# Altium schematic sheet MCU_SEC.SchDoc
size A3; PageSetup: Record=PageOptions|CenterHorizontal=True|CenterVertical=True|PrintScale=0.73|XCorrection=1.00|YCorrection=1.00|PrintKind=0|BorderSize=5000000|LeftOffset=0|BottomOffset=0|Orientation=2|PaperLength=1000|PaperWidth=1000|Scale=100|PaperSource=7|PrintQuality=-4|MediaType=1|DitherType=10|PaperKind=A4|PrintScaleMode=1
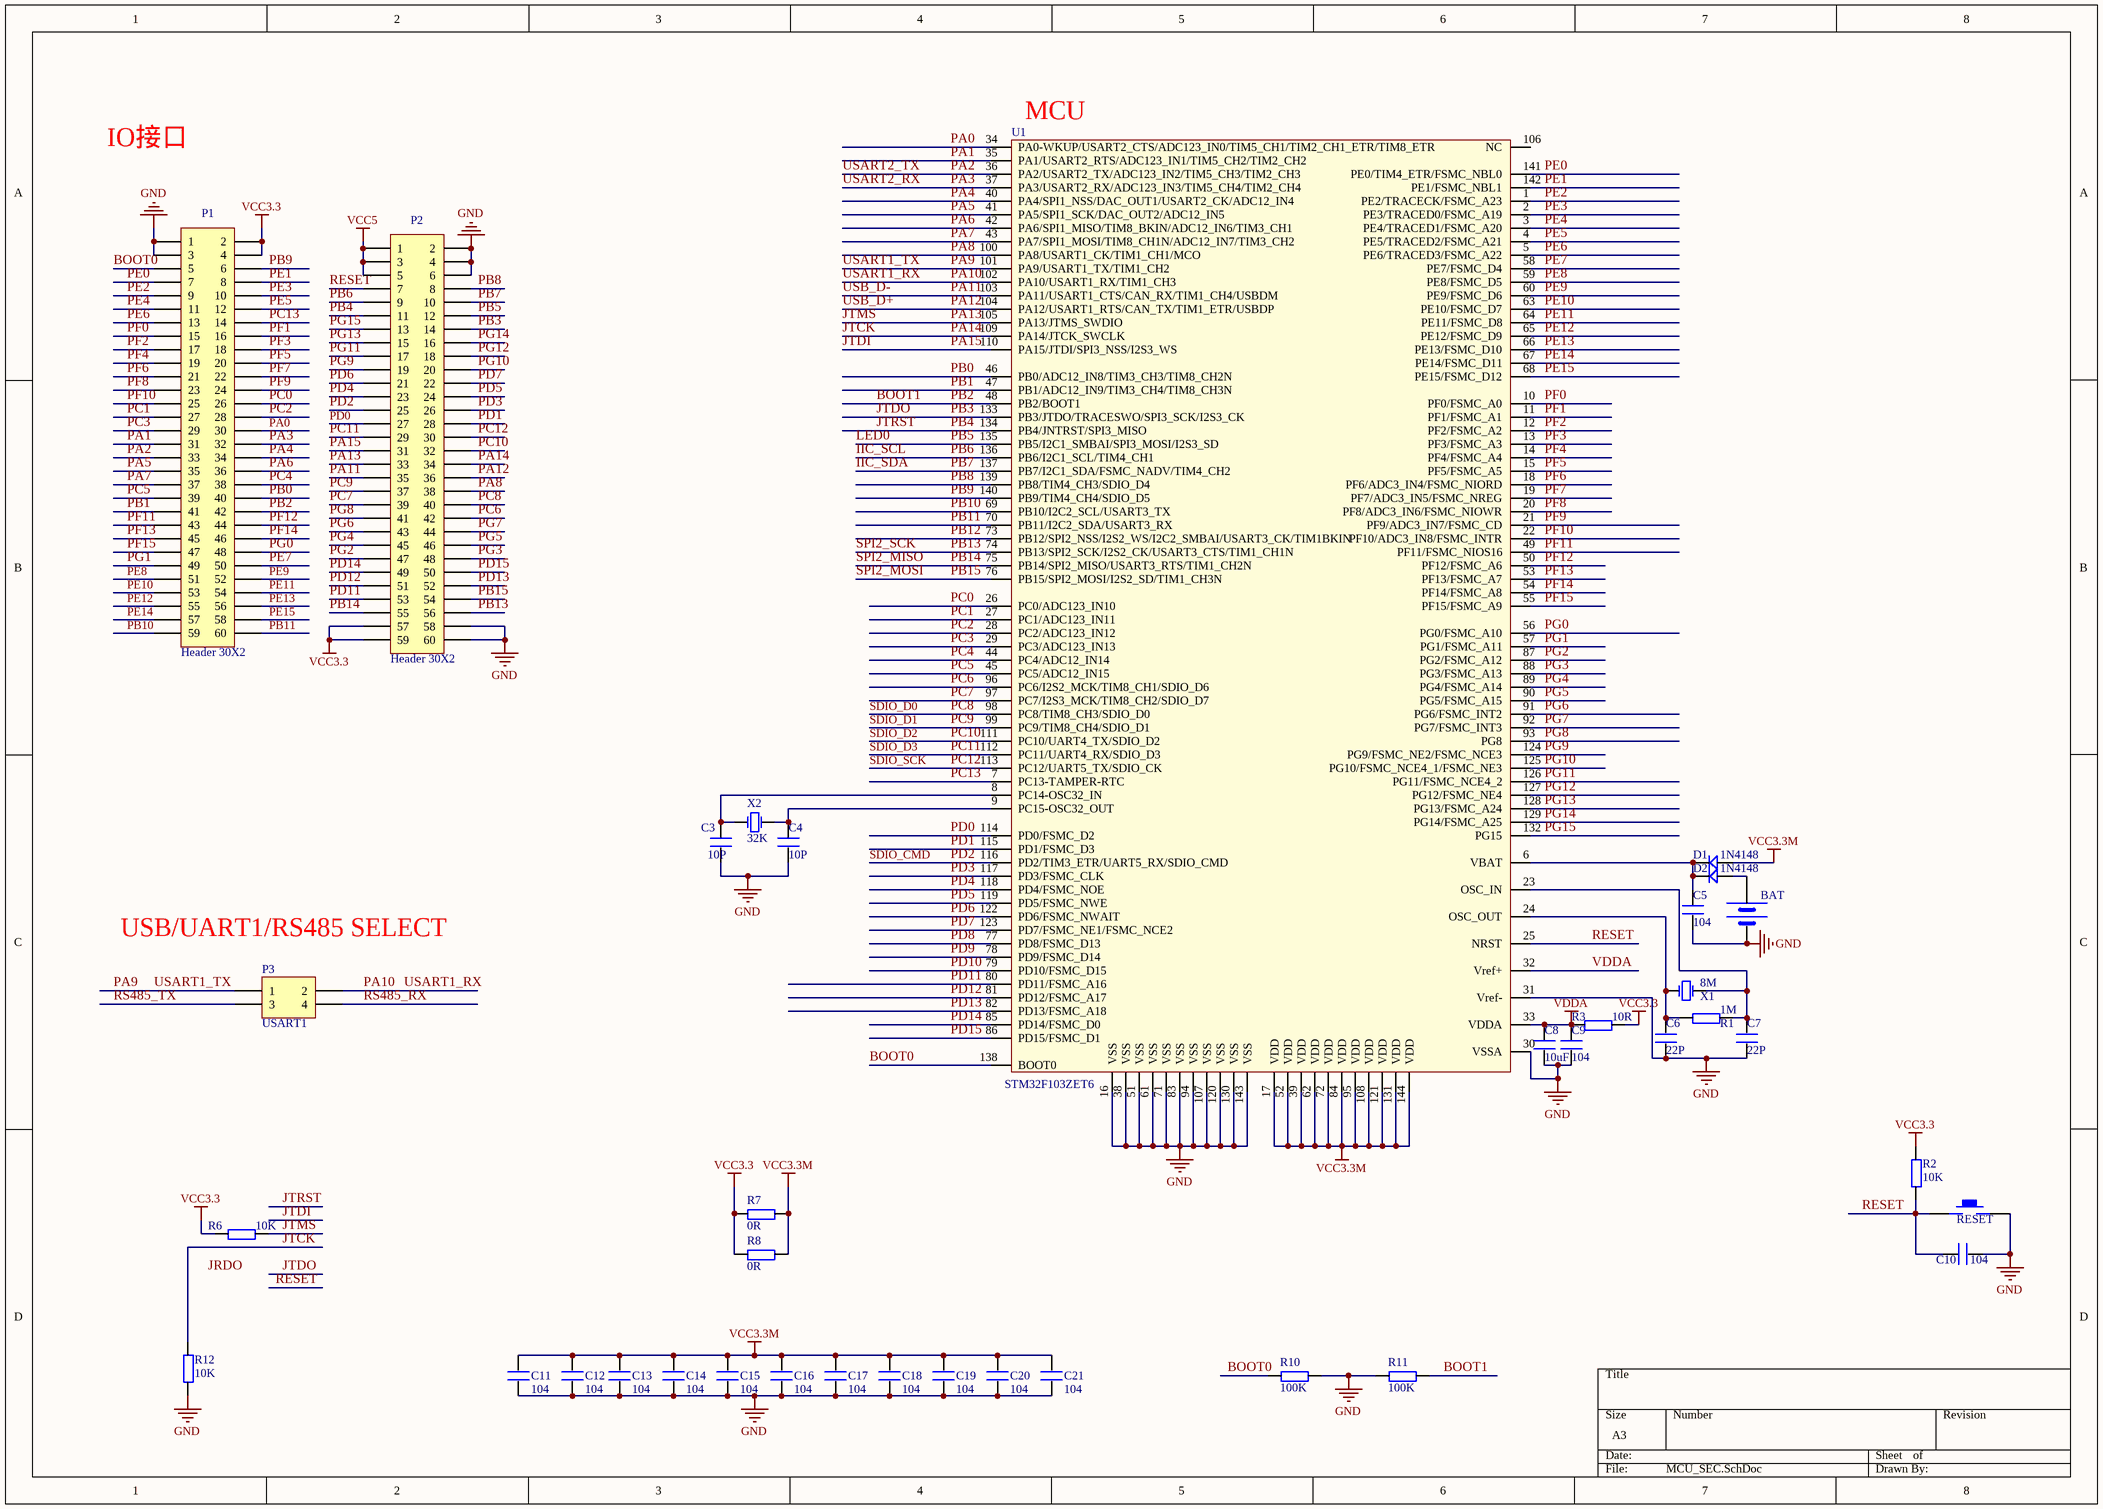
[diagram p0: MCU_SEC.SchDoc]

## Parts
BAT  BATT  [BATML]  (value not drawn)
C3  10P  [0603CL]
C4  10P  [0603CL]
C5  104  [0603CL]
C6  22P  [0603CL]
C7  22P  [0603CL]
C8  10uF  [0603CL]
C9  104  [0603CL]
C10  104  [0603CL]
C11  104  [0603CL]
C12  104  [0603CL]
C13  104  [0603CL]
C14  104  [0603CL]
C15  104  [0603CL]
C16  104  [0603CL]
C17  104  [0603CL]
C18  104  [0603CL]
C19  104  [0603CL]
C20  104  [0603CL]
C21  104  [0603CL]
D1  1N4148  [LL-34(1/2)L]
D2  1N4148  [LL-34(1/2)L]
P1  Header 30X2  [HDR2X30]
P2  Header 30X2  [HDR2X30]
P3  USART1  [HDR2X2]
R1  1M  [0603L]
R2  10K  [0603L]
R3  10R  [0603L]
R6  10K  [0603L]
R7  0R  [0603L]
R8  0R  [0603L]
R10  100K  [0603L]
R11  100K  [0603L]
R12  10K  [0603L]
RESET  KEY_M  [SW2 - MINI1]  (value not drawn)
U1  STM32F103ZET6  [LQFP144L]
X1  8M  [OSC-5032-2P]
X2  32K  [OSC-306]

## Nets
GND: BAT.2(GND) C3.1 C4.1 C5.1 C6.1 C7.1 C8.1 C9.1 C10.1 C11.2 C12.2 C13.2 C14.2 C15.2 C16.2 C17.2 C18.2 C19.2 C20.2 C21.2 P1.1 P1.3 P2.2 P2.4 P2.6 P2.58 P2.60 R10.2 R11.1 R12.1 RESET.2 U1.16(VSS) U1.30(VSSA) U1.31(Vref-) U1.38(VSS) U1.51(VSS) U1.61(VSS) U1.71(VSS) U1.83(VSS) U1.94(VSS) U1.107(VSS) U1.120(VSS) U1.130(VSS) U1.143(VSS)
VCC3.3: P1.2 P1.4 P2.57 P2.59 R2.2 R3.2 R6.1 R7.1 R8.1
VCC3.3M: C11.1 C12.1 C13.1 C14.1 C15.1 C16.1 C17.1 C18.1 C19.1 C20.1 C21.1 D1.1 R7.2 R8.2 U1.17(VDD) U1.39(VDD) U1.52(VDD) U1.62(VDD) U1.72(VDD) U1.84(VDD) U1.95(VDD) U1.108(VDD) U1.121(VDD) U1.131(VDD) U1.144(VDD)
VCC5: P2.1 P2.3 P2.5
VDDA: C8.2 C9.2 R3.1 U1.32(Vref+) U1.33(VDDA)
BOOT0: P1.5 R10.1 U1.138(BOOT0)
BOOT1: P1.42 R11.2 U1.48(PB2/BOOT1)  [also labelled PB2]
IIC_SCL: P2.9 U1.136(PB6/I2C1_SCL/TIM4_CH1)  [also labelled PB6]
IIC_SDA: P2.10 U1.137(PB7/I2C1_SDA/FSMC_NADV/TIM4_CH2)  [also labelled PB7]
JTCK: P2.34 R12.2 U1.109(PA14/JTCK_SWCLK)  [also labelled PA14]
JTDI: P2.31 U1.110(PA15/JTDI/SPI3_NSS/I2S3_WS)  [also labelled PA15]
JTDO: P2.14 U1.133(PB3/JTDO/TRACESWO/SPI3_SCK/I2S3_CK)  [also labelled PB3]
JTMS: P2.33 R6.2 U1.105(PA13/JTMS_SWDIO)  [also labelled PA13]
JTRST: P2.11 U1.134(PB4/JNTRST/SPI3_MISO)  [also labelled PB4]
LED0: P2.12 U1.135(PB5/I2C1_SMBAI/SPI3_MOSI/I2S3_SD)  [also labelled PB5]
PA0: P1.30 U1.34(PA0-WKUP/USART2_CTS/ADC123_IN0/TIM5_CH1/TIM2_CH1_ETR/TIM8_ETR)
PA1: P1.31 U1.35(PA1/USART2_RTS/ADC123_IN1/TIM5_CH2/TIM2_CH2)
PA2: P1.33 U1.36(PA2/USART2_TX/ADC123_IN2/TIM5_CH3/TIM2_CH3)  [also labelled USART2_TX]
PA3: P1.32 U1.37(PA3/USART2_RX/ADC123_IN3/TIM5_CH4/TIM2_CH4)  [also labelled USART2_RX]
PA4: P1.34 U1.40(PA4/SPI1_NSS/DAC_OUT1/USART2_CK/ADC12_IN4)
PA5: P1.35 U1.41(PA5/SPI1_SCK/DAC_OUT2/ADC12_IN5)
PA6: P1.36 U1.42(PA6/SPI1_MISO/TIM8_BKIN/ADC12_IN6/TIM3_CH1)
PA7: P1.37 U1.43(PA7/SPI1_MOSI/TIM8_CH1N/ADC12_IN7/TIM3_CH2)
PA8: P2.38 U1.100(PA8/USART1_CK/TIM1_CH1/MCO)
PA9: P3.1 U1.101(PA9/USART1_TX/TIM1_CH2)  [also labelled USART1_TX]
PA10: P3.2 U1.102(PA10/USART1_RX/TIM1_CH3)  [also labelled USART1_RX]
PA11: P2.35 U1.103(PA11/USART1_CTS/CAN_RX/TIM1_CH4/USBDM)  [also labelled USB_D-]
PA12: P2.36 U1.104(PA12/USART1_RTS/CAN_TX/TIM1_ETR/USBDP)  [also labelled USB_D+]
PB0: P1.40 U1.46(PB0/ADC12_IN8/TIM3_CH3/TIM8_CH2N)
PB1: P1.41 U1.47(PB1/ADC12_IN9/TIM3_CH4/TIM8_CH3N)
PB8: P2.8 U1.139(PB8/TIM4_CH3/SDIO_D4)
PB9: P1.6 U1.140(PB9/TIM4_CH4/SDIO_D5)
PB10: P1.59 U1.69(PB10/I2C2_SCL/USART3_TX)
PB11: P1.60 U1.70(PB11/I2C2_SDA/USART3_RX)
PB12: U1.73(PB12/SPI2_NSS/I2S2_WS/I2C2_SMBAI/USART3_CK/TIM1BKIN)
PB13: P2.56 U1.74(PB13/SPI2_SCK/I2S2_CK/USART3_CTS/TIM1_CH1N)  [also labelled SPI2_SCK]
PB14: P2.55 U1.75(PB14/SPI2_MISO/USART3_RTS/TIM1_CH2N)  [also labelled SPI2_MISO]
PB15: P2.54 U1.76(PB15/SPI2_MOSI/I2S2_SD/TIM1_CH3N)  [also labelled SPI2_MOSI]
PC0: P1.26 U1.26(PC0/ADC123_IN10)
PC1: P1.27 U1.27(PC1/ADC123_IN11)
PC2: P1.28 U1.28(PC2/ADC123_IN12)
PC3: P1.29 U1.29(PC3/ADC123_IN13)
PC4: P1.38 U1.44(PC4/ADC12_IN14)
PC5: P1.39 U1.45(PC5/ADC12_IN15)
PC6: P2.42 U1.96(PC6/I2S2_MCK/TIM8_CH1/SDIO_D6)
PC7: P2.39 U1.97(PC7/I2S3_MCK/TIM8_CH2/SDIO_D7)
PC8: P2.40 U1.98(PC8/TIM8_CH3/SDIO_D0)  [also labelled SDIO_D0]
PC9: P2.37 U1.99(PC9/TIM8_CH4/SDIO_D1)  [also labelled SDIO_D1]
PC10: P2.32 U1.111(PC10/UART4_TX/SDIO_D2)  [also labelled SDIO_D2]
PC11: P2.29 U1.112(PC11/UART4_RX/SDIO_D3)  [also labelled SDIO_D3]
PC12: P2.30 U1.113(PC12/UART5_TX/SDIO_CK)  [also labelled SDIO_SCK]
PC13: P1.14 U1.7(PC13-TAMPER-RTC)
PD0: P2.27 U1.114(PD0/FSMC_D2)
PD1: P2.28 U1.115(PD1/FSMC_D3)
PD2: P2.25 U1.116(PD2/TIM3_ETR/UART5_RX/SDIO_CMD)  [also labelled SDIO_CMD]
PD3: P2.26 U1.117(PD3/FSMC_CLK)
PD4: P2.23 U1.118(PD4/FSMC_NOE)
PD5: P2.24 U1.119(PD5/FSMC_NWE)
PD6: P2.21 U1.122(PD6/FSMC_NWAIT)
PD7: P2.22 U1.123(PD7/FSMC_NE1/FSMC_NCE2)
PD8: U1.77(PD8/FSMC_D13)
PD9: U1.78(PD9/FSMC_D14)
PD10: U1.79(PD10/FSMC_D15)
PD11: P2.53 U1.80(PD11/FSMC_A16)
PD12: P2.51 U1.81(PD12/FSMC_A17)
PD13: P2.52 U1.82(PD13/FSMC_A18)
PD14: P2.49 U1.85(PD14/FSMC_D0)
PD15: P2.50 U1.86(PD15/FSMC_D1)
PE0: P1.7 U1.141(PE0/TIM4_ETR/FSMC_NBL0)
PE1: P1.8 U1.142(PE1/FSMC_NBL1)
PE2: P1.9 U1.1(PE2/TRACECK/FSMC_A23)
PE3: P1.10 U1.2(PE3/TRACED0/FSMC_A19)
PE4: P1.11 U1.3(PE4/TRACED1/FSMC_A20)
PE5: P1.12 U1.4(PE5/TRACED2/FSMC_A21)
PE6: P1.13 U1.5(PE6/TRACED3/FSMC_A22)
PE7: P1.50 U1.58(PE7/FSMC_D4)
PE8: P1.51 U1.59(PE8/FSMC_D5)
PE9: P1.52 U1.60(PE9/FSMC_D6)
PE10: P1.53 U1.63(PE10/FSMC_D7)
PE11: P1.54 U1.64(PE11/FSMC_D8)
PE12: P1.55 U1.65(PE12/FSMC_D9)
PE13: P1.56 U1.66(PE13/FSMC_D10)
PE14: P1.57 U1.67(PE14/FSMC_D11)
PE15: P1.58 U1.68(PE15/FSMC_D12)
PF0: P1.15 U1.10(PF0/FSMC_A0)
PF1: P1.16 U1.11(PF1/FSMC_A1)
PF2: P1.17 U1.12(PF2/FSMC_A2)
PF3: P1.18 U1.13(PF3/FSMC_A3)
PF4: P1.19 U1.14(PF4/FSMC_A4)
PF5: P1.20 U1.15(PF5/FSMC_A5)
PF6: P1.21 U1.18(PF6/ADC3_IN4/FSMC_NIORD)
PF7: P1.22 U1.19(PF7/ADC3_IN5/FSMC_NREG)
PF8: P1.23 U1.20(PF8/ADC3_IN6/FSMC_NIOWR)
PF9: P1.24 U1.21(PF9/ADC3_IN7/FSMC_CD)
PF10: P1.25 U1.22(PF10/ADC3_IN8/FSMC_INTR)
PF11: P1.43 U1.49(PF11/FSMC_NIOS16)
PF12: P1.44 U1.50(PF12/FSMC_A6)
PF13: P1.45 U1.53(PF13/FSMC_A7)
PF14: P1.46 U1.54(PF14/FSMC_A8)
PF15: P1.47 U1.55(PF15/FSMC_A9)
PG0: P1.48 U1.56(PG0/FSMC_A10)
PG1: P1.49 U1.57(PG1/FSMC_A11)
PG2: P2.47 U1.87(PG2/FSMC_A12)
PG3: P2.48 U1.88(PG3/FSMC_A13)
PG4: P2.45 U1.89(PG4/FSMC_A14)
PG5: P2.46 U1.90(PG5/FSMC_A15)
PG6: P2.43 U1.91(PG6/FSMC_INT2)
PG7: P2.44 U1.92(PG7/FSMC_INT3)
PG8: P2.41 U1.93(PG8)
PG9: P2.19 U1.124(PG9/FSMC_NE2/FSMC_NCE3)
PG10: P2.20 U1.125(PG10/FSMC_NCE4_1/FSMC_NE3)
PG11: P2.17 U1.126(PG11/FSMC_NCE4_2)
PG12: P2.18 U1.127(PG12/FSMC_NE4)
PG13: P2.15 U1.128(PG13/FSMC_A24)
PG14: P2.16 U1.129(PG14/FSMC_A25)
PG15: P2.13 U1.132(PG15)
RESET: C10.2 P2.7 R2.1 RESET.1 U1.25(NRST)
RS485_RX: P3.4
RS485_TX: P3.3
NetBAT_1: BAT.1(VCC) D2.1
NetC3_2: C3.2 U1.8(PC14-OSC32_IN) X2.1(OSC1)
NetC4_2: C4.2 U1.9(PC15-OSC32_OUT) X2.2(OSC2)
NetC5_2: C5.2 D1.2 D2.2 U1.6(VBAT)
NetC6_2: C6.2 R1.1 U1.24(OSC_OUT) X1.1(OSC1)
NetC7_2: C7.2 R1.2 U1.23(OSC_IN) X1.2(OSC2)

Not connected (* = marked no-connect by the designer): U1 106(NC)

## Notes on the sheet
- IO接口
- (near U1) MCU
- (near P3) USB/UART1/RS485 SELECT
- Labels drawn without touching a wire or pin: JRDO

## Library data of the parts
BAT = BAT
C3-C21 = C
D1 D2 = D
P1 P2 = Header 30X2: Header, 30-Pin, Dual row; LatestRevisionDate: 17-Jul-2002; LatestRevisionNote: Re-released for DXP Platform.; Publisher: Altium Limited
P3 = Header 2X2: Header, 2-Pin, Dual row; LatestRevisionDate: 17-Jul-2002; LatestRevisionNote: Re-released for DXP Platform.; Publisher: Altium Limited
R1-R3 R6-R8 R10-R12 = R
X1 X2 = XTAL_1: Crystal Oscillator; Published: 8-Jun-2000; LatestRevisionDate: 17-Jul-2002; LatestRevisionNote: Re-released for DXP Platform.; Publisher: Altium Limited